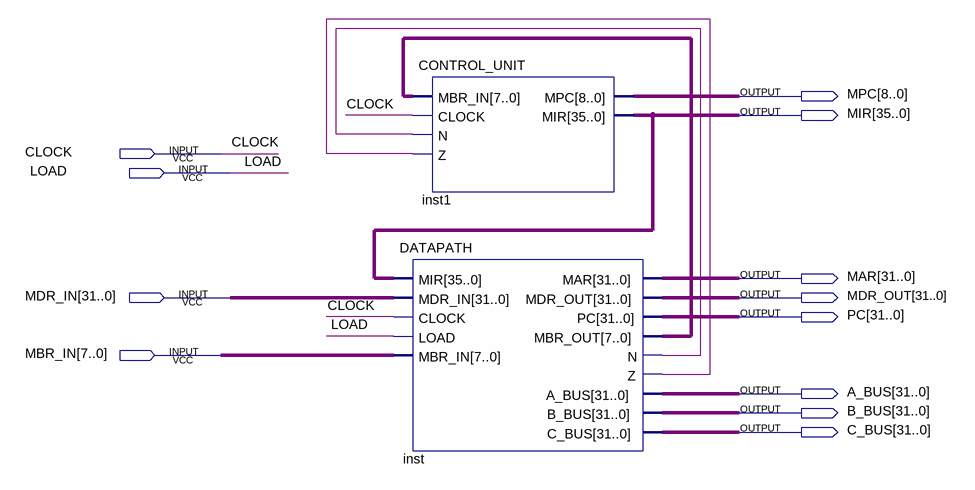
[diagram p0: schematic sheet]
// Quartus schematic CPU.bdf as structural Verilog: 2 symbols, 12 pins
module CPU (
  input  CLOCK,
  input  LOAD,
  input  [31:0] MDR_IN,
  input  [7:0] MBR_IN,
  output [8:0] MPC,
  output [35:0] MIR,
  output [31:0] MAR,
  output [31:0] MDR_OUT,
  output [31:0] PC,
  output [31:0] A_BUS,
  output [31:0] B_BUS,
  output [31:0] C_BUS
);

  wire inst_n, inst_z;
  wire [7:0] inst_mbr_out;

  DATAPATH inst (
    .MIR(MIR), .MDR_IN(MDR_IN), .CLOCK(CLOCK), .LOAD(LOAD), .MBR_IN(MBR_IN), .MAR(MAR), .MDR_OUT(MDR_OUT),
    .PC(PC), .MBR_OUT(inst_mbr_out), .N(inst_n), .Z(inst_z), .A_BUS(A_BUS), .B_BUS(B_BUS), .C_BUS(C_BUS));
  CONTROL_UNIT inst1 (.MBR_IN(inst_mbr_out), .CLOCK(CLOCK), .N(inst_n), .Z(inst_z), .MPC(MPC), .MIR(MIR));
endmodule
